# EAGLE schematic Luftschiff_V0.1 (EAGLE 9.5.2)
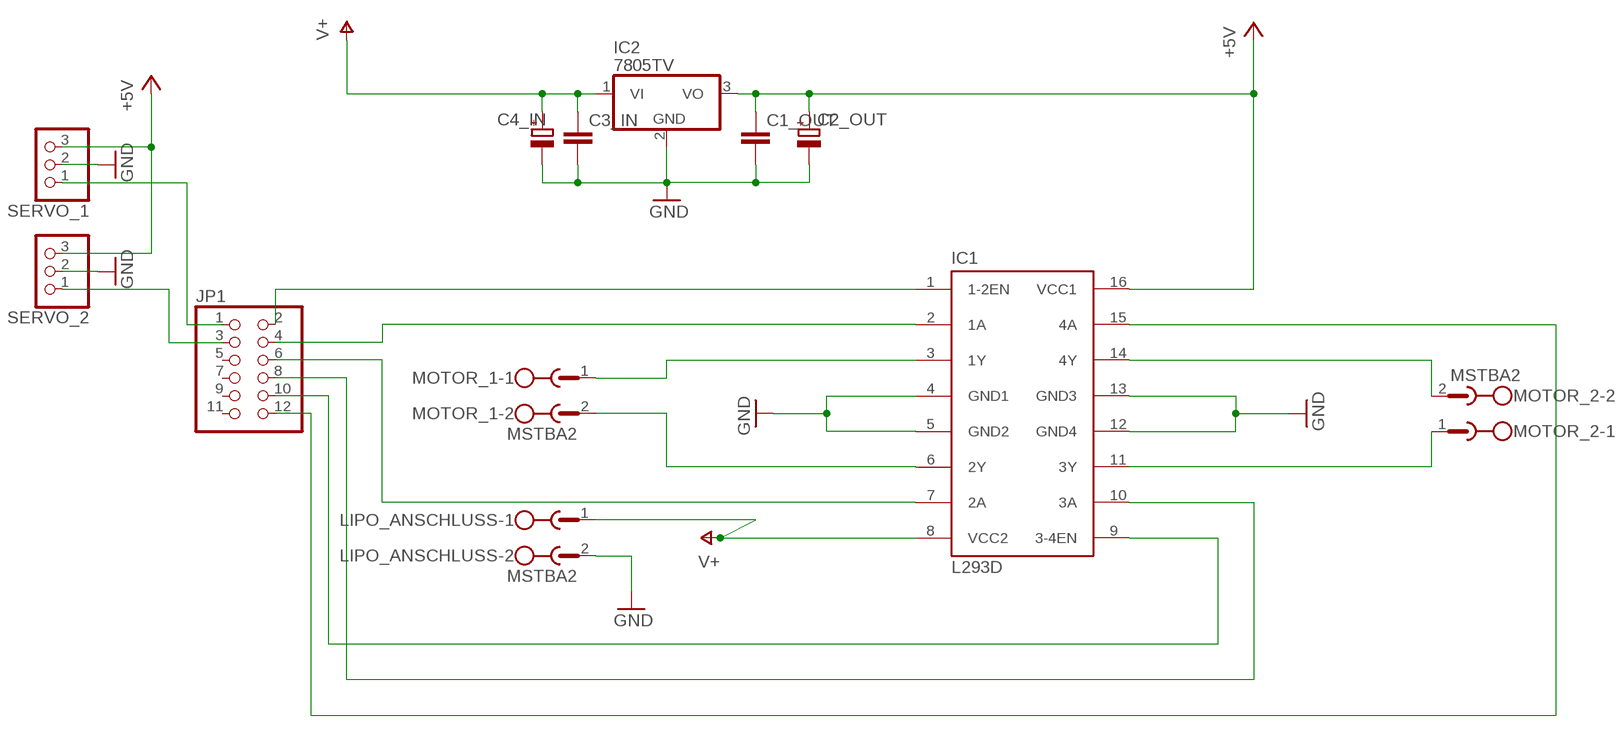
[diagram p0: schematic, sheet 1]

## Parts
C1_OUT  C-EU025-040X050  [C025-040X050]
C2_OUT  CPOL-EUE2.5-6  [E2,5-6]
C3_IN  C-EU025-040X050  [C025-040X050]
C4_IN  CPOL-EUE2.5-6  [E2,5-6]
IC1  L293D  [DIL16]
IC2  7805TV  [TO220V]
JP1  PINHD-2X6/90  [2X06/90]
LIPO_ANSCHLUSS  MSTBA2  [MSTBA2]
MOTOR_1  MSTBA2  [MSTBA2]
MOTOR_2  MSTBA2  [MSTBA2]
SERVO_1  PINHD-1X3  [1X03]
SERVO_2  PINHD-1X3  [1X03]

## Nets
+5V: C1_OUT.1 C2_OUT.+ IC1.16(VCC1) IC2.3(VO) SERVO_1.3 SERVO_2.3
GND: C1_OUT.2 C2_OUT.- C3_IN.2 C4_IN.- IC1.4(GND1) IC1.5(GND2) IC1.12(GND4) IC1.13(GND3) IC2.2(GND) LIPO_ANSCHLUSS.2 SERVO_1.2 SERVO_2.2
N$1: JP1.1 SERVO_1.1
N$2: JP1.3 SERVO_2.1
N$3: IC1.11(3Y) MOTOR_2.1
N$4: IC1.14(4Y) MOTOR_2.2
N$5: IC1.3(1Y) MOTOR_1.1
N$6: IC1.6(2Y) MOTOR_1.2
N$7: IC1.1(1-2EN) JP1.2
N$8: IC1.2(1A) JP1.4
N$9: IC1.7(2A) JP1.6
N$10: IC1.10(3A) JP1.8
N$11: IC1.9(3-4EN) JP1.10
N$12: IC1.15(4A) JP1.12
V+: C3_IN.1 C4_IN.+ IC1.8(VCC2) IC2.1(VI) LIPO_ANSCHLUSS.1
Unconnected: JP1.5 JP1.7 JP1.9 JP1.11

## Library data of the parts
C1_OUT C3_IN = rcl:C-EU: CAPACITOR, European symbol; SPICEPREFIX: C
C2_OUT C4_IN = rcl:CPOL-EU: POLARIZED CAPACITOR, European symbol; SPICEPREFIX: C
IC1 = st-microelectronics:L293D: PUSH-PULL 4 CHANNEL DRIVER; MPN: L293D; OC_FARNELL: 9589619; OC_NEWARK: 56P8249
IC2 = linear:78*: Positive VOLTAGE REGULATOR Source: http://cache.national.com/ds/LM/LM78L05.pdf http://www.fairchildsemi.com/ds/LM/LM7805.pdf
JP1 = pinhead:PINHD-2X6: PIN HEADER
LIPO_ANSCHLUSS MOTOR_1 MOTOR_2 = con-phoenix-508:MSTBA2: PHOENIX; MF: FARNELL; MPN: 1757242; OC_FARNELL: 3705171; OC_NEWARK: 71C4161
SERVO_1 SERVO_2 = pinhead:PINHD-1X3: PIN HEADER